# EasyEDA schematic SCH_Dual voltage converter_2022-07-17.json
TITLE: Dual voltage converter; REV: 1.0; Date: 2022-07-10; Sheet: 1/1; Drawn By: Towed ROV 2022; Company: NTNU
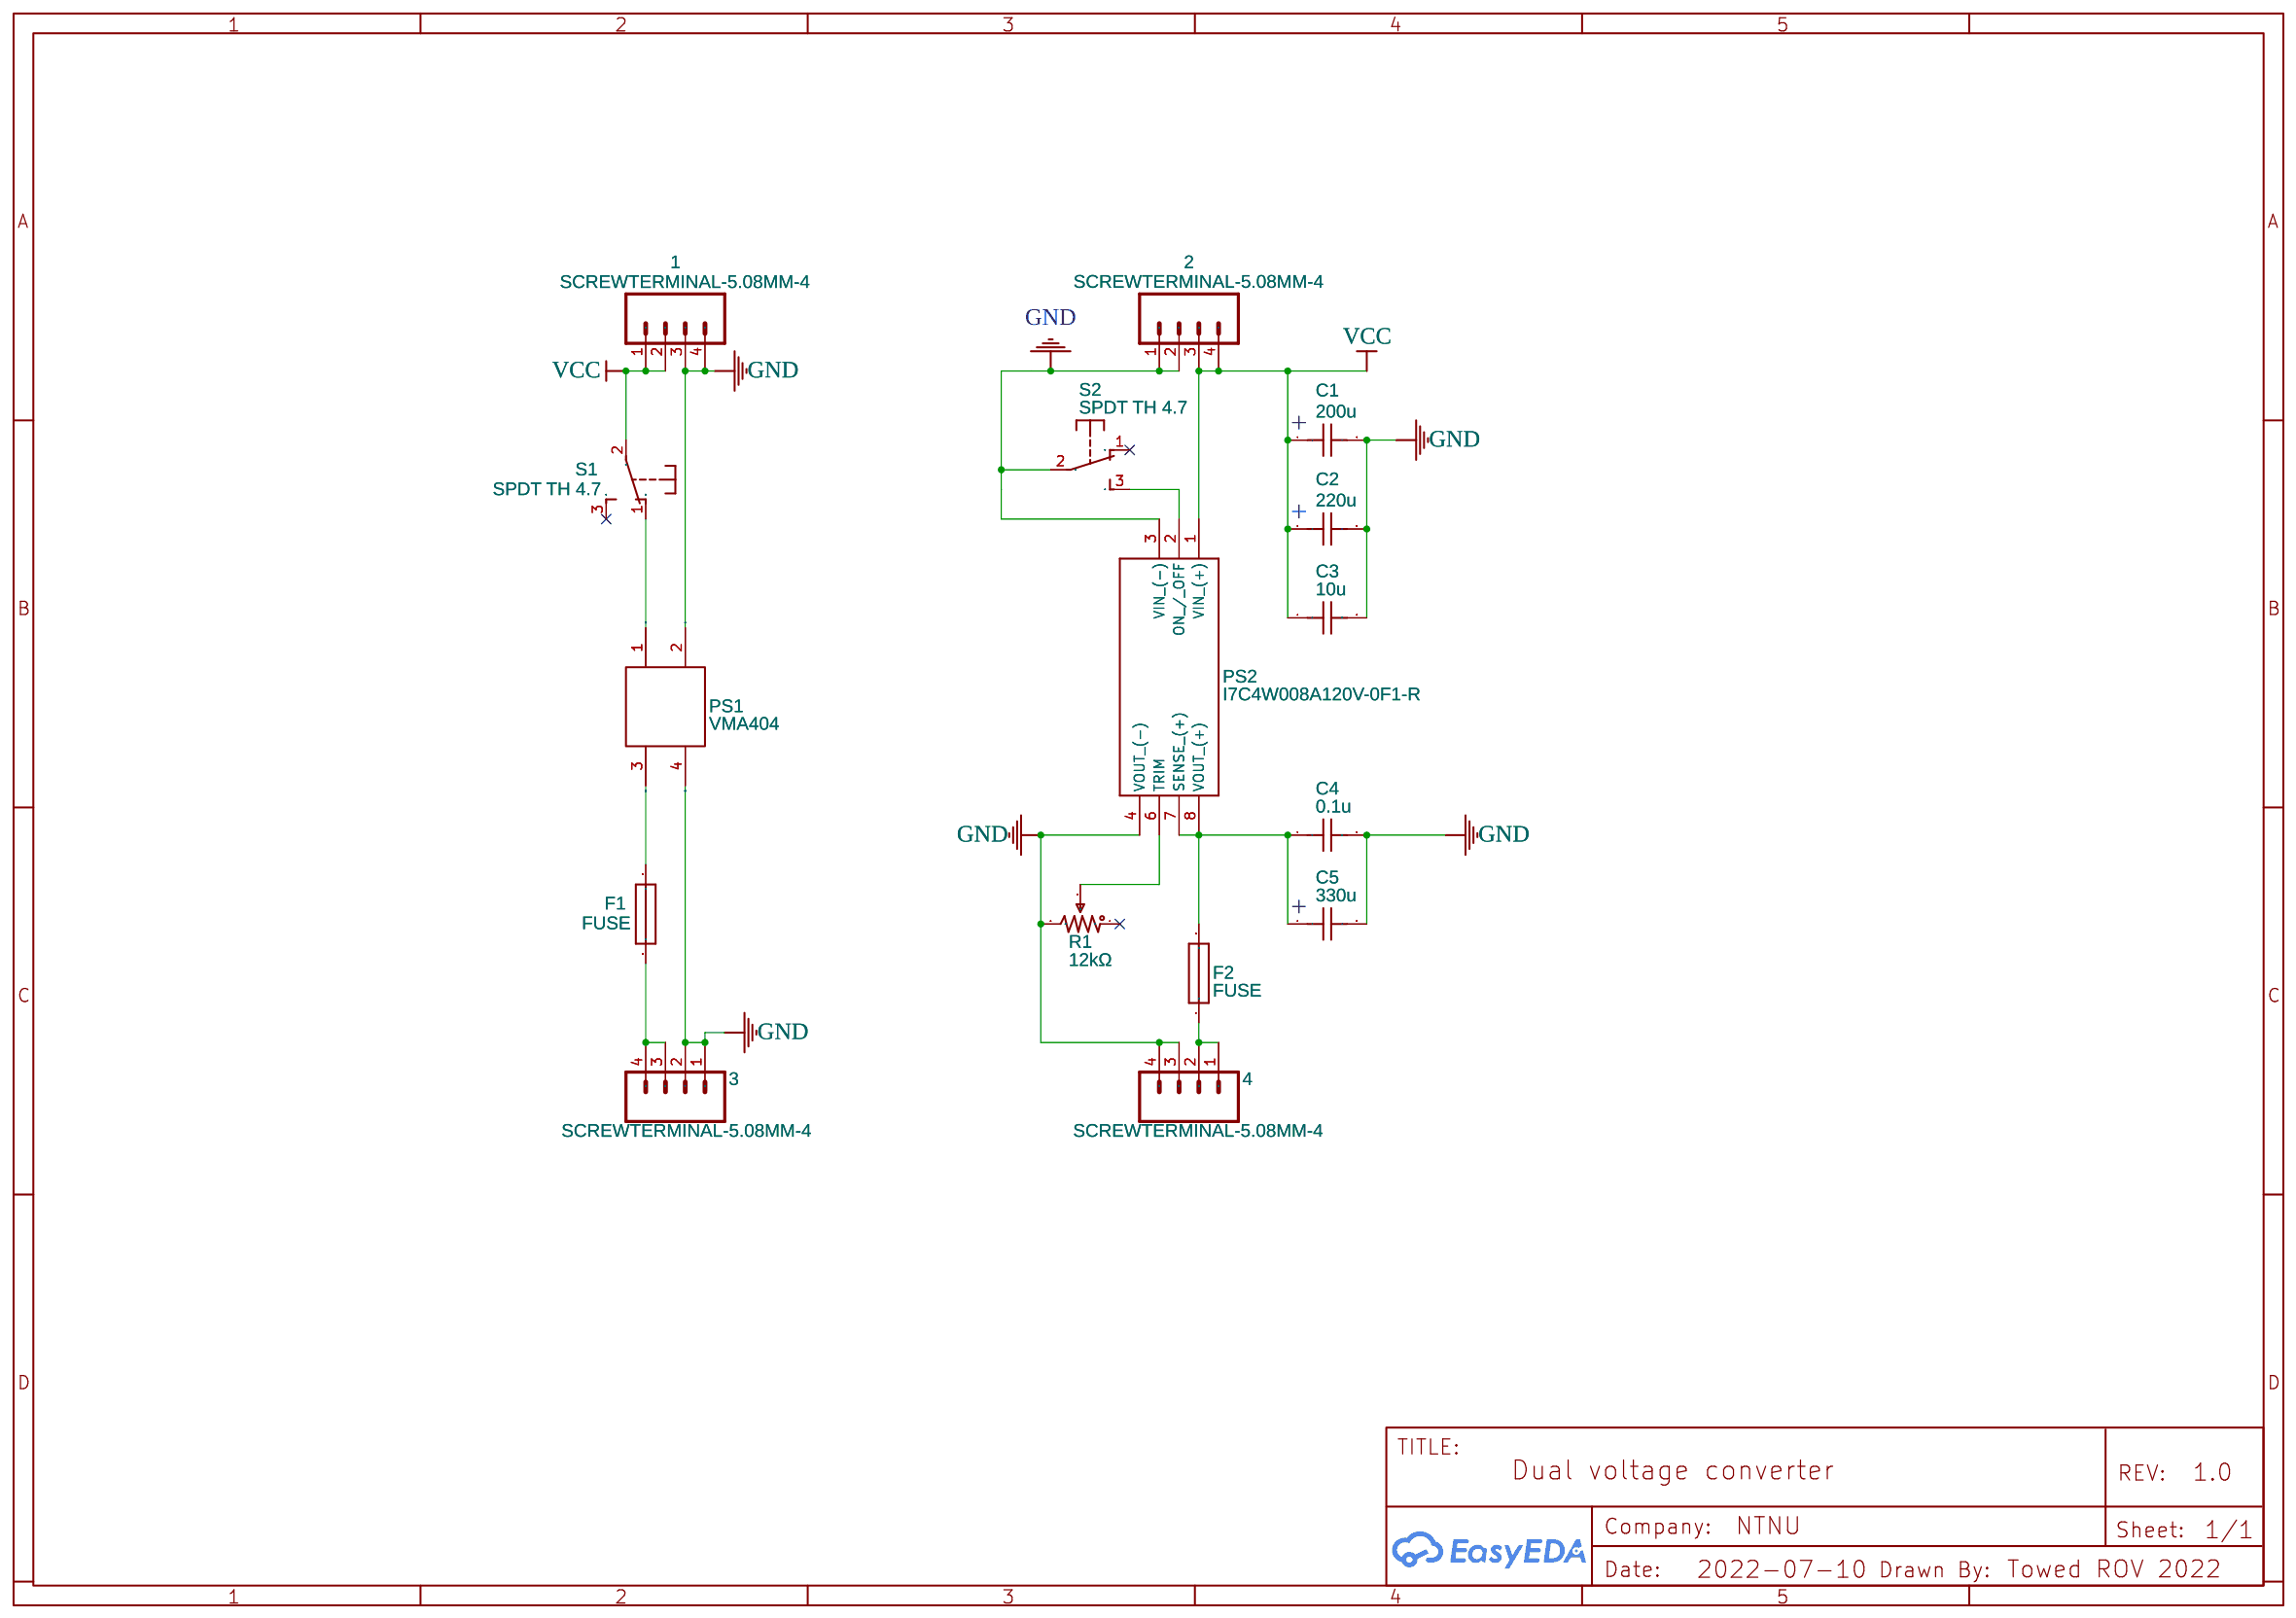
[diagram p0: schematic sheet]

## Parts
1  SCREWTERMINAL-5.08MM-4  [SCREWTERMINAL-5.08MM-4P-8X20MM]
2  SCREWTERMINAL-5.08MM-4  [SCREWTERMINAL-5.08MM-4P-8X20MM]
3  SCREWTERMINAL-5.08MM-4  [SCREWTERMINAL-5.08MM-4P-8X20MM]
4  SCREWTERMINAL-5.08MM-4  [SCREWTERMINAL-5.08MM-4P-8X20MM]
C1  200u  [CAP-Z-10MMX25MM-BIGFOOT]
C2  220u  [CAP-Z-10MMX25MM-BIGFOOT]
C3  10u  [CAP 5MM]
C4  0.1u  [CAP 5MM]
C5  330u  [CAP-Z-10MMX25MM-BIGFOOT]
F1  FUSE  [FUSE HOLDER 5X20MM]
F2  FUSE  [FUSE HOLDER 5X20MM]
PS1  VMA404  [VMA404 STEP DOWN MODULE LM2596S]
PS2  I7C4W008A120V-0F1-R  [I7C4W008A120V001R]
R1  12kΩ  [RES-ADJ-TH_3266W]
S1  SPDT TH 4.7  [TOGGLE SWITCH SPDT RED 3 PIN ON-OFF-ON 3 SPDT SMALL AC 6A/125V 3A/250V]
S2  SPDT TH 4.7  [TOGGLE SWITCH SPDT RED 3 PIN ON-OFF-ON 3 SPDT SMALL AC 6A/125V 3A/250V]

## Library data of the parts
1-4 = SCREWTERMINAL-5.08MM-4: Contributor: mich21050
C1 C2 C4 C5 = C_0603_US: Contributor: LCEDA_Lib
C3 = C_0603_US: Contributor: LCEDA_Lib; Package Display: No
F1 F2 = FUSEHOLDER BLUE: Manufacturer: Littlefuse, Inc.; Manufacturer Part: 64900001039; link: https://docs.rs-online.com/d3d4/0900766b8128f4b9.pdf; Contributor: peter_uk
PS1 = VM404Lib: Manufacturer Part: New SchematicLib; Contributor: ReneSchrauwers; Supplier: Conrad; Supplier Part: 1612753; Manufacturer: Velleman; Package Display: No
PS2 = I7C4W008A120V-001-R: Contributor: Paul
R1 = 3266W-1-102LF: Supplier: LCSC; Supplier Part: C780233; Manufacturer: BOURNS; JLCPCB Part Class: Extended Part; Contributor: lcsc
S1 S2 = SPDT TH 4.7: Contributor: Guest

## Nets
GND: 1.3 1.4 2.1 2.2 3.1 3.2 4.3 4.4 C1.2(-) C2.2(-) C3.2 C4.2 C5.2(-) PS1.2(-VIN) PS1.4(-VOUT) PS2.3(VIN_(-)) PS2.4(VOUT_(-)) R1.3 S2.2(P)
VCC: 1.1 1.2 2.3 2.4 C1.1(+) C2.1(+) C3.1 PS2.1(VIN_(+)) S1.2(P)
Net-(3-3): 3.3 3.4 F1.1
Net-(4-1): 4.1 4.2 F2.1
Net-(C4-1): C4.1 C5.1(+) F2.2 PS2.7(SENSE_(+)) PS2.8(VOUT_(+))
Net-(F1-2): F1.2 PS1.3(+VOUT)
Net-(PS1-1): PS1.1(+VIN) S1.1(O)
Net-(PS2-2): PS2.2(ON_/_OFF) S2.3(S)
Net-(PS2-6): PS2.6(TRIM) R1.2

Not connected (* = marked no-connect by the designer): R1 1*; S1 3(S)*; S2 1(O)*

## Notes on the sheet
- +
- +
- +
